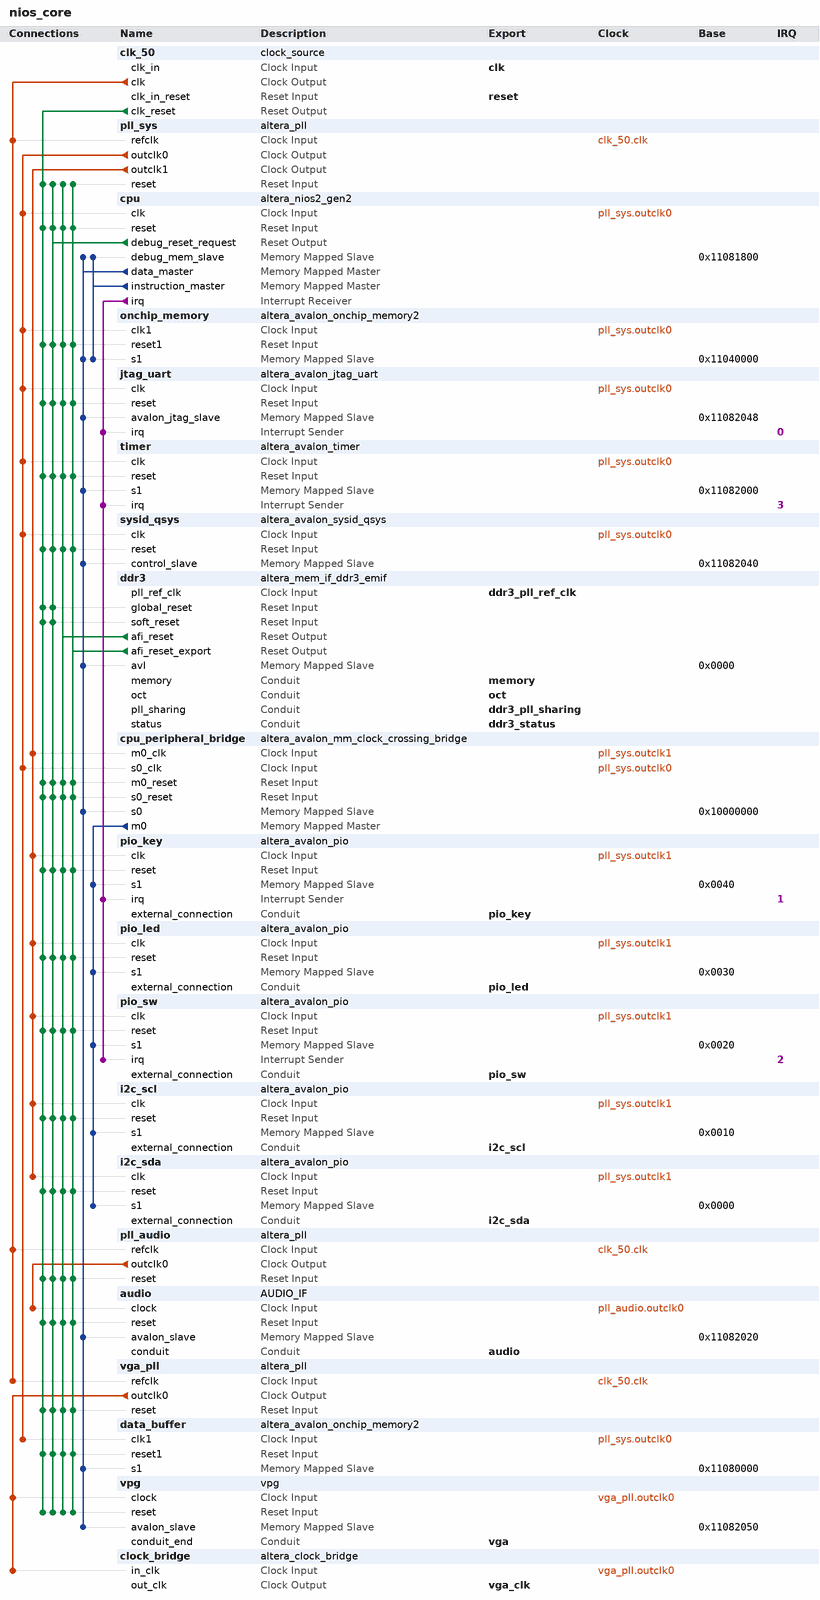
[diagram p0: system contents]
# Platform Designer (Qsys) system nios_core, Cyclone V 5CSXFC6D6F31C6
# Parameters at their usual value, and those the tool derives, are not listed.
package require -exact qsys 17.1
create_system nios_core
set_project_property DEVICE_FAMILY {Cyclone V}
set_project_property DEVICE 5CSXFC6D6F31C6

add_instance clk_50 clock_source 17.1
set_instance_parameter_value clk_50 clockFrequency 50000000

add_instance pll_sys altera_pll 17.1
set_instance_parameter_value pll_sys gui_device_speed_grade 2
set_instance_parameter_value pll_sys gui_number_of_clocks 2
set_instance_parameter_value pll_sys gui_operation_mode normal
set_instance_parameter_value pll_sys gui_output_clock_frequency0 100.0
set_instance_parameter_value pll_sys gui_output_clock_frequency1 10.0
set_instance_parameter_value pll_sys gui_pll_mode {Integer-N PLL}
set_instance_parameter_value pll_sys gui_reference_clock_frequency 50.0
set_instance_parameter_value pll_sys gui_use_locked false

add_instance cpu altera_nios2_gen2 17.1
set_instance_parameter_value cpu dcache_size 2048
set_instance_parameter_value cpu dividerType srt2
set_instance_parameter_value cpu exceptionSlave onchip_memory.s1
set_instance_parameter_value cpu icache_size 4096
set_instance_parameter_value cpu impl Fast
set_instance_parameter_value cpu resetSlave onchip_memory.s1
set_instance_parameter_value cpu setting_activateTrace true

add_instance onchip_memory altera_avalon_onchip_memory2 17.1
set_instance_parameter_value onchip_memory dataWidth 32
set_instance_parameter_value onchip_memory dualPort false
set_instance_parameter_value onchip_memory initMemContent true
set_instance_parameter_value onchip_memory initializationFileName onchip_memory2_1
set_instance_parameter_value onchip_memory memorySize 262144

add_instance jtag_uart altera_avalon_jtag_uart 17.1
set_instance_parameter_value jtag_uart simInteractiveOptions INTERACTIVE_ASCII_OUTPUT

add_instance timer altera_avalon_timer 17.1
set_instance_parameter_value timer period 1
set_instance_parameter_value timer periodUnits MSEC

add_instance sysid_qsys altera_avalon_sysid_qsys 17.1
set_instance_parameter_value sysid_qsys id 1702376049

add_instance ddr3 altera_mem_if_ddr3_emif 17.1
set_instance_parameter_value ddr3 AVL_MAX_SIZE 32
set_instance_parameter_value ddr3 CALIBRATION_MODE Full
set_instance_parameter_value ddr3 CPORT_TYPE_PORT Bidirectional,Bidirectional,Bidirectional,Bidirectional,Bidirectional,Bidirectional
set_instance_parameter_value ddr3 EXPORT_AFI_HALF_CLK true
set_instance_parameter_value ddr3 HARD_EMIF false
set_instance_parameter_value ddr3 MEM_BANKADDR_WIDTH 3
set_instance_parameter_value ddr3 MEM_CLK_FREQ 300.0
set_instance_parameter_value ddr3 MEM_CLK_FREQ_MAX 400.0
set_instance_parameter_value ddr3 MEM_COL_ADDR_WIDTH 8
set_instance_parameter_value ddr3 MEM_DQ_WIDTH 32
set_instance_parameter_value ddr3 MEM_FORMAT DISCRETE
set_instance_parameter_value ddr3 MEM_ROW_ADDR_WIDTH 15
set_instance_parameter_value ddr3 MEM_TCL 6
set_instance_parameter_value ddr3 MEM_TFAW_NS 50.0
set_instance_parameter_value ddr3 MEM_TRAS_NS 37.5
set_instance_parameter_value ddr3 MEM_TRCD_NS 15.0
set_instance_parameter_value ddr3 MEM_TRFC_NS 300.0
set_instance_parameter_value ddr3 MEM_TRP_NS 15.0
set_instance_parameter_value ddr3 MEM_TRRD_NS 13.2
set_instance_parameter_value ddr3 MEM_TRTP_NS 13.2
set_instance_parameter_value ddr3 MEM_TWTR 4
set_instance_parameter_value ddr3 MEM_VENDOR JEDEC
set_instance_parameter_value ddr3 MEM_WTCL 5
set_instance_parameter_value ddr3 PLL_LOCATION Top_Bottom
set_instance_parameter_value ddr3 POWER_OF_TWO_BUS false
set_instance_parameter_value ddr3 PRIORITY_PORT 1,1,1,1,1,1
set_instance_parameter_value ddr3 RATE Half
set_instance_parameter_value ddr3 REF_CLK_FREQ 50.0
set_instance_parameter_value ddr3 SPEED_GRADE 6
set_instance_parameter_value ddr3 TIMING_BOARD_AC_SKEW 0.03
set_instance_parameter_value ddr3 TIMING_BOARD_AC_TO_CK_SKEW 0.0
set_instance_parameter_value ddr3 TIMING_BOARD_DQ_TO_DQS_SKEW 0.0
set_instance_parameter_value ddr3 TIMING_BOARD_MAX_CK_DELAY 0.03
set_instance_parameter_value ddr3 TIMING_BOARD_MAX_DQS_DELAY 0.03
set_instance_parameter_value ddr3 TIMING_BOARD_SKEW_BETWEEN_DQS 0.08
set_instance_parameter_value ddr3 TIMING_BOARD_SKEW_CKDQS_DIMM_MAX 0.0
set_instance_parameter_value ddr3 TIMING_BOARD_SKEW_CKDQS_DIMM_MIN 0.0
set_instance_parameter_value ddr3 TIMING_BOARD_SKEW_WITHIN_DQS 0.01
set_instance_parameter_value ddr3 TIMING_TDH 150
set_instance_parameter_value ddr3 TIMING_TDQSCK 400
set_instance_parameter_value ddr3 TIMING_TDQSQ 200
set_instance_parameter_value ddr3 TIMING_TDQSS 0.25
set_instance_parameter_value ddr3 TIMING_TDS 75
set_instance_parameter_value ddr3 TIMING_TDSH 0.2
set_instance_parameter_value ddr3 TIMING_TDSS 0.2
set_instance_parameter_value ddr3 TIMING_TIH 275
set_instance_parameter_value ddr3 TIMING_TIS 200
set_instance_parameter_value ddr3 TIMING_TQSH 0.38
set_instance_parameter_value ddr3 USER_DEBUG_LEVEL 0

add_instance cpu_peripheral_bridge altera_avalon_mm_clock_crossing_bridge 17.1
set_instance_parameter_value cpu_peripheral_bridge ADDRESS_WIDTH 9
set_instance_parameter_value cpu_peripheral_bridge COMMAND_FIFO_DEPTH 32
set_instance_parameter_value cpu_peripheral_bridge DATA_WIDTH 32
set_instance_parameter_value cpu_peripheral_bridge MASTER_SYNC_DEPTH 3
set_instance_parameter_value cpu_peripheral_bridge MAX_BURST_SIZE 1
set_instance_parameter_value cpu_peripheral_bridge RESPONSE_FIFO_DEPTH 64
set_instance_parameter_value cpu_peripheral_bridge SLAVE_SYNC_DEPTH 3
set_instance_parameter_value cpu_peripheral_bridge USE_AUTO_ADDRESS_WIDTH 0

add_instance pio_key altera_avalon_pio 17.1
set_instance_parameter_value pio_key captureEdge true
set_instance_parameter_value pio_key direction Input
set_instance_parameter_value pio_key edgeType FALLING
set_instance_parameter_value pio_key generateIRQ true
set_instance_parameter_value pio_key irqType EDGE
set_instance_parameter_value pio_key width 4

add_instance pio_led altera_avalon_pio 17.1
set_instance_parameter_value pio_led direction Output
set_instance_parameter_value pio_led width 4

add_instance pio_sw altera_avalon_pio 17.1
set_instance_parameter_value pio_sw captureEdge true
set_instance_parameter_value pio_sw direction Input
set_instance_parameter_value pio_sw edgeType FALLING
set_instance_parameter_value pio_sw generateIRQ true
set_instance_parameter_value pio_sw irqType EDGE
set_instance_parameter_value pio_sw width 4

add_instance i2c_scl altera_avalon_pio 17.1
set_instance_parameter_value i2c_scl direction Output
set_instance_parameter_value i2c_scl width 1

add_instance i2c_sda altera_avalon_pio 17.1
set_instance_parameter_value i2c_sda direction Bidir
set_instance_parameter_value i2c_sda width 1

add_instance pll_audio altera_pll 17.1
set_instance_parameter_value pll_audio gui_device_speed_grade 2
set_instance_parameter_value pll_audio gui_number_of_clocks 1
set_instance_parameter_value pll_audio gui_operation_mode normal
set_instance_parameter_value pll_audio gui_output_clock_frequency0 18.432
set_instance_parameter_value pll_audio gui_pll_mode {Fractional-N PLL}
set_instance_parameter_value pll_audio gui_reference_clock_frequency 50.0
set_instance_parameter_value pll_audio gui_use_locked false

add_instance audio AUDIO_IF 1.0

add_instance vga_pll altera_pll 17.1
set_instance_parameter_value vga_pll gui_device_speed_grade 1
set_instance_parameter_value vga_pll gui_number_of_clocks 1
set_instance_parameter_value vga_pll gui_operation_mode direct
set_instance_parameter_value vga_pll gui_output_clock_frequency0 25.175
set_instance_parameter_value vga_pll gui_pll_mode {Integer-N PLL}
set_instance_parameter_value vga_pll gui_reference_clock_frequency 50.0
set_instance_parameter_value vga_pll gui_use_locked false

add_instance data_buffer altera_avalon_onchip_memory2 17.1
set_instance_parameter_value data_buffer dataWidth 32
set_instance_parameter_value data_buffer dualPort false
set_instance_parameter_value data_buffer initMemContent true
set_instance_parameter_value data_buffer initializationFileName onchip_mem.hex
set_instance_parameter_value data_buffer memorySize 4096

add_instance vpg vpg 1.0
set_instance_parameter_value vpg BITS_PER_SYMBOL 24
set_instance_parameter_value vpg H_BPORCH 48
set_instance_parameter_value vpg H_DISP 640
set_instance_parameter_value vpg H_FPORCH 16
set_instance_parameter_value vpg H_SYNC 96
set_instance_parameter_value vpg MAX_CHANNEL 0
set_instance_parameter_value vpg READY_LATENCY 0
set_instance_parameter_value vpg SYMBOLS_PER_BEAT 1
set_instance_parameter_value vpg V_BPORCH 33
set_instance_parameter_value vpg V_DISP 480
set_instance_parameter_value vpg V_FPORCH 10
set_instance_parameter_value vpg V_SYNC 2

add_instance clock_bridge altera_clock_bridge 17.1
set_instance_parameter_value clock_bridge DERIVED_CLOCK_RATE 25175644
set_instance_parameter_value clock_bridge EXPLICIT_CLOCK_RATE 0

# connections
add_connection clk_50.clk pll_audio.refclk clock
add_connection clk_50.clk pll_sys.refclk clock
add_connection clk_50.clk vga_pll.refclk clock
add_connection pll_audio.outclk0 audio.clock clock
add_connection pll_sys.outclk0 cpu.clk clock
add_connection pll_sys.outclk0 cpu_peripheral_bridge.s0_clk clock
add_connection pll_sys.outclk0 data_buffer.clk1 clock
add_connection pll_sys.outclk0 jtag_uart.clk clock
add_connection pll_sys.outclk0 onchip_memory.clk1 clock
add_connection pll_sys.outclk0 sysid_qsys.clk clock
add_connection pll_sys.outclk0 timer.clk clock
add_connection pll_sys.outclk1 cpu_peripheral_bridge.m0_clk clock
add_connection pll_sys.outclk1 i2c_scl.clk clock
add_connection pll_sys.outclk1 i2c_sda.clk clock
add_connection pll_sys.outclk1 pio_key.clk clock
add_connection pll_sys.outclk1 pio_led.clk clock
add_connection pll_sys.outclk1 pio_sw.clk clock
add_connection vga_pll.outclk0 clock_bridge.in_clk clock
add_connection vga_pll.outclk0 vpg.clock clock
add_connection clk_50.clk_reset audio.reset reset
add_connection clk_50.clk_reset cpu.reset reset
add_connection clk_50.clk_reset cpu_peripheral_bridge.m0_reset reset
add_connection clk_50.clk_reset cpu_peripheral_bridge.s0_reset reset
add_connection clk_50.clk_reset data_buffer.reset1 reset
add_connection clk_50.clk_reset ddr3.global_reset reset
add_connection clk_50.clk_reset ddr3.soft_reset reset
add_connection clk_50.clk_reset i2c_scl.reset reset
add_connection clk_50.clk_reset i2c_sda.reset reset
add_connection clk_50.clk_reset jtag_uart.reset reset
add_connection clk_50.clk_reset onchip_memory.reset1 reset
add_connection clk_50.clk_reset pio_key.reset reset
add_connection clk_50.clk_reset pio_led.reset reset
add_connection clk_50.clk_reset pio_sw.reset reset
add_connection clk_50.clk_reset pll_audio.reset reset
add_connection clk_50.clk_reset pll_sys.reset reset
add_connection clk_50.clk_reset sysid_qsys.reset reset
add_connection clk_50.clk_reset timer.reset reset
add_connection clk_50.clk_reset vga_pll.reset reset
add_connection clk_50.clk_reset vpg.reset reset
add_connection cpu.debug_reset_request audio.reset reset
add_connection cpu.debug_reset_request cpu.reset reset
add_connection cpu.debug_reset_request cpu_peripheral_bridge.m0_reset reset
add_connection cpu.debug_reset_request cpu_peripheral_bridge.s0_reset reset
add_connection cpu.debug_reset_request data_buffer.reset1 reset
add_connection cpu.debug_reset_request ddr3.global_reset reset
add_connection cpu.debug_reset_request ddr3.soft_reset reset
add_connection cpu.debug_reset_request i2c_scl.reset reset
add_connection cpu.debug_reset_request i2c_sda.reset reset
add_connection cpu.debug_reset_request jtag_uart.reset reset
add_connection cpu.debug_reset_request onchip_memory.reset1 reset
add_connection cpu.debug_reset_request pio_key.reset reset
add_connection cpu.debug_reset_request pio_led.reset reset
add_connection cpu.debug_reset_request pio_sw.reset reset
add_connection cpu.debug_reset_request pll_audio.reset reset
add_connection cpu.debug_reset_request pll_sys.reset reset
add_connection cpu.debug_reset_request sysid_qsys.reset reset
add_connection cpu.debug_reset_request timer.reset reset
add_connection cpu.debug_reset_request vga_pll.reset reset
add_connection cpu.debug_reset_request vpg.reset reset
add_connection ddr3.afi_reset audio.reset reset
add_connection ddr3.afi_reset cpu.reset reset
add_connection ddr3.afi_reset cpu_peripheral_bridge.m0_reset reset
add_connection ddr3.afi_reset cpu_peripheral_bridge.s0_reset reset
add_connection ddr3.afi_reset data_buffer.reset1 reset
add_connection ddr3.afi_reset i2c_scl.reset reset
add_connection ddr3.afi_reset i2c_sda.reset reset
add_connection ddr3.afi_reset jtag_uart.reset reset
add_connection ddr3.afi_reset onchip_memory.reset1 reset
add_connection ddr3.afi_reset pio_key.reset reset
add_connection ddr3.afi_reset pio_led.reset reset
add_connection ddr3.afi_reset pio_sw.reset reset
add_connection ddr3.afi_reset pll_audio.reset reset
add_connection ddr3.afi_reset pll_sys.reset reset
add_connection ddr3.afi_reset sysid_qsys.reset reset
add_connection ddr3.afi_reset timer.reset reset
add_connection ddr3.afi_reset vga_pll.reset reset
add_connection ddr3.afi_reset vpg.reset reset
add_connection ddr3.afi_reset_export audio.reset reset
add_connection ddr3.afi_reset_export cpu.reset reset
add_connection ddr3.afi_reset_export cpu_peripheral_bridge.m0_reset reset
add_connection ddr3.afi_reset_export cpu_peripheral_bridge.s0_reset reset
add_connection ddr3.afi_reset_export data_buffer.reset1 reset
add_connection ddr3.afi_reset_export i2c_scl.reset reset
add_connection ddr3.afi_reset_export i2c_sda.reset reset
add_connection ddr3.afi_reset_export jtag_uart.reset reset
add_connection ddr3.afi_reset_export onchip_memory.reset1 reset
add_connection ddr3.afi_reset_export pio_key.reset reset
add_connection ddr3.afi_reset_export pio_led.reset reset
add_connection ddr3.afi_reset_export pio_sw.reset reset
add_connection ddr3.afi_reset_export pll_audio.reset reset
add_connection ddr3.afi_reset_export pll_sys.reset reset
add_connection ddr3.afi_reset_export sysid_qsys.reset reset
add_connection ddr3.afi_reset_export timer.reset reset
add_connection ddr3.afi_reset_export vga_pll.reset reset
add_connection ddr3.afi_reset_export vpg.reset reset
add_connection cpu.data_master audio.avalon_slave avalon
set_connection_parameter_value cpu.data_master/audio.avalon_slave baseAddress 0x11082020
add_connection cpu.data_master cpu.debug_mem_slave avalon
set_connection_parameter_value cpu.data_master/cpu.debug_mem_slave baseAddress 0x11081800
add_connection cpu.data_master cpu_peripheral_bridge.s0 avalon
set_connection_parameter_value cpu.data_master/cpu_peripheral_bridge.s0 baseAddress 0x10000000
add_connection cpu.data_master data_buffer.s1 avalon
set_connection_parameter_value cpu.data_master/data_buffer.s1 baseAddress 0x11080000
add_connection cpu.data_master ddr3.avl avalon
set_connection_parameter_value cpu.data_master/ddr3.avl baseAddress 0x0000
add_connection cpu.data_master jtag_uart.avalon_jtag_slave avalon
set_connection_parameter_value cpu.data_master/jtag_uart.avalon_jtag_slave baseAddress 0x11082048
add_connection cpu.data_master onchip_memory.s1 avalon
set_connection_parameter_value cpu.data_master/onchip_memory.s1 baseAddress 0x11040000
add_connection cpu.data_master sysid_qsys.control_slave avalon
set_connection_parameter_value cpu.data_master/sysid_qsys.control_slave baseAddress 0x11082040
add_connection cpu.data_master timer.s1 avalon
set_connection_parameter_value cpu.data_master/timer.s1 baseAddress 0x11082000
add_connection cpu.data_master vpg.avalon_slave avalon
set_connection_parameter_value cpu.data_master/vpg.avalon_slave baseAddress 0x11082050
add_connection cpu.instruction_master cpu.debug_mem_slave avalon
set_connection_parameter_value cpu.instruction_master/cpu.debug_mem_slave baseAddress 0x11081800
add_connection cpu.instruction_master onchip_memory.s1 avalon
set_connection_parameter_value cpu.instruction_master/onchip_memory.s1 baseAddress 0x11040000
add_connection cpu_peripheral_bridge.m0 i2c_scl.s1 avalon
set_connection_parameter_value cpu_peripheral_bridge.m0/i2c_scl.s1 baseAddress 0x0010
add_connection cpu_peripheral_bridge.m0 i2c_sda.s1 avalon
set_connection_parameter_value cpu_peripheral_bridge.m0/i2c_sda.s1 baseAddress 0x0000
add_connection cpu_peripheral_bridge.m0 pio_key.s1 avalon
set_connection_parameter_value cpu_peripheral_bridge.m0/pio_key.s1 baseAddress 0x0040
add_connection cpu_peripheral_bridge.m0 pio_led.s1 avalon
set_connection_parameter_value cpu_peripheral_bridge.m0/pio_led.s1 baseAddress 0x0030
add_connection cpu_peripheral_bridge.m0 pio_sw.s1 avalon
set_connection_parameter_value cpu_peripheral_bridge.m0/pio_sw.s1 baseAddress 0x0020
add_connection cpu.irq jtag_uart.irq interrupt
set_connection_parameter_value cpu.irq/jtag_uart.irq irqNumber 0
add_connection cpu.irq pio_key.irq interrupt
set_connection_parameter_value cpu.irq/pio_key.irq irqNumber 1
add_connection cpu.irq pio_sw.irq interrupt
set_connection_parameter_value cpu.irq/pio_sw.irq irqNumber 2
add_connection cpu.irq timer.irq interrupt
set_connection_parameter_value cpu.irq/timer.irq irqNumber 3

# exported interfaces
add_interface audio conduit end
set_interface_property audio EXPORT_OF audio.conduit
add_interface clk clock sink
set_interface_property clk EXPORT_OF clk_50.clk_in
add_interface ddr3_pll_ref_clk clock sink
set_interface_property ddr3_pll_ref_clk EXPORT_OF ddr3.pll_ref_clk
add_interface ddr3_pll_sharing conduit end
set_interface_property ddr3_pll_sharing EXPORT_OF ddr3.pll_sharing
add_interface ddr3_status conduit end
set_interface_property ddr3_status EXPORT_OF ddr3.status
add_interface i2c_scl conduit end
set_interface_property i2c_scl EXPORT_OF i2c_scl.external_connection
add_interface i2c_sda conduit end
set_interface_property i2c_sda EXPORT_OF i2c_sda.external_connection
add_interface memory conduit end
set_interface_property memory EXPORT_OF ddr3.memory
add_interface oct conduit end
set_interface_property oct EXPORT_OF ddr3.oct
add_interface pio_key conduit end
set_interface_property pio_key EXPORT_OF pio_key.external_connection
add_interface pio_led conduit end
set_interface_property pio_led EXPORT_OF pio_led.external_connection
add_interface pio_sw conduit end
set_interface_property pio_sw EXPORT_OF pio_sw.external_connection
add_interface reset reset sink
set_interface_property reset EXPORT_OF clk_50.clk_in_reset
add_interface vga conduit end
set_interface_property vga EXPORT_OF vpg.conduit_end
add_interface vga_clk clock source
set_interface_property vga_clk EXPORT_OF clock_bridge.out_clk

set_interconnect_requirement {$system} qsys_mm.clockCrossingAdapter HANDSHAKE
set_interconnect_requirement {$system} qsys_mm.maxAdditionalLatency 0

save_system nios_core.qsys
